# Altium schematic sheet 8051.SchDoc
size A
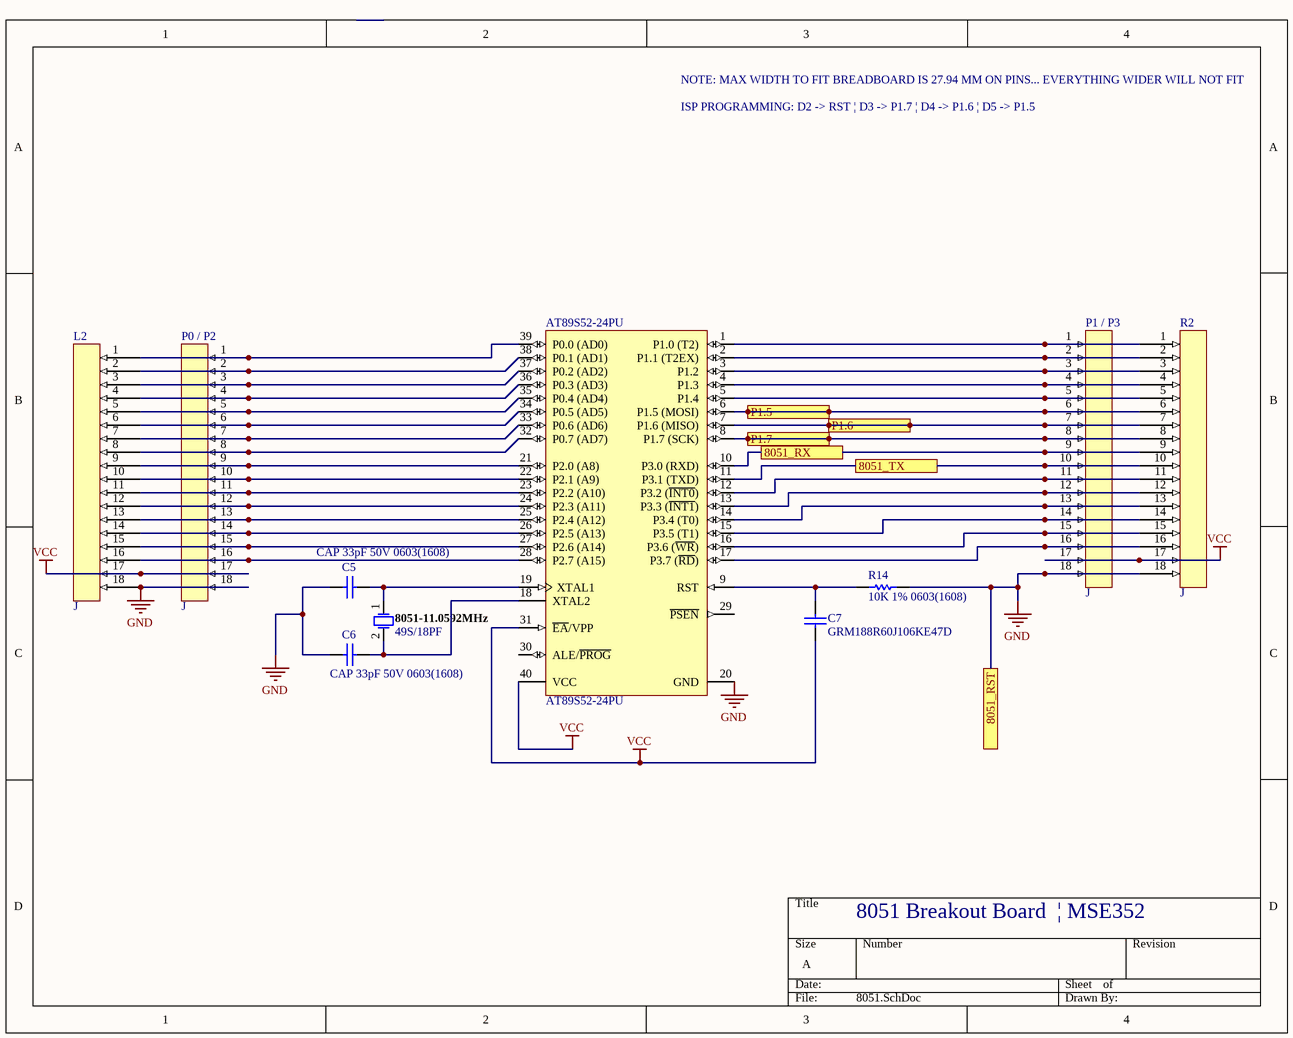
[diagram p0: 8051.SchDoc]

## Parts
8051-11.0592MHz  49S/18PF  [JPY-49S-18PF]
AT89S52-24PU  AT89S52-24PU  [ATML-40P6]
C5  CAP 33pF 50V 0603(1608)  [CAPC0603(1608)100_L]
C6  CAP 33pF 50V 0603(1608)  [CAPC0603(1608)100_L]
C7  GRM188R60J106KE47D  [CAPC1608X90X38LL10T18]
L2  J  [16 pin holes]
P0_/_P2  J  [16 pin holes]
P1_/_P3  J  [16 pin holes]
R2  J  [16 pin holes]
R14  10K 1% 0603(1608)  [RESC0603(1608)_N]

## Ports
8051_RST, 8051_RX, 8051_TX, P1.5, P1.6, P1.7

## Nets
GND: AT89S52-24PU.20(GND) C5.1 C6.1 L2.18 P0_/_P2.18 P1_/_P3.18 R2.18 R14.2 ; port 8051_RST
VCC: AT89S52-24PU.31(~{EA}/VPP) AT89S52-24PU.40(VCC) C7.1 L2.17 P0_/_P2.17 P1_/_P3.17 R2.17
8051_RX: AT89S52-24PU.10(P3.0_(RXD)) P1_/_P3.9 R2.9 ; port 8051_RX
8051_TX: AT89S52-24PU.11(P3.1_(TXD)) P1_/_P3.10 R2.10 ; port 8051_TX
P1.5: AT89S52-24PU.6(P1.5_(MOSI)) P1_/_P3.6 R2.6 ; port P1.5
P1.6: AT89S52-24PU.7(P1.6_(MISO)) P1_/_P3.7 R2.7 ; port P1.6
P1.7: AT89S52-24PU.8(P1.7_(SCK)) P1_/_P3.8 R2.8 ; port P1.7
Net8051-11.0592MHz_1: 8051-11.0592MHz.1 AT89S52-24PU.19(XTAL1) C5.2
Net8051-11.0592MHz_2: 8051-11.0592MHz.2 AT89S52-24PU.18(XTAL2) C6.2
NetAT89S52-24PU_1: AT89S52-24PU.1(P1.0_(T2)) P1_/_P3.1 R2.1
NetAT89S52-24PU_2: AT89S52-24PU.2(P1.1_(T2EX)) P1_/_P3.2 R2.2
NetAT89S52-24PU_3: AT89S52-24PU.3(P1.2) P1_/_P3.3 R2.3
NetAT89S52-24PU_4: AT89S52-24PU.4(P1.3) P1_/_P3.4 R2.4
NetAT89S52-24PU_5: AT89S52-24PU.5(P1.4) P1_/_P3.5 R2.5
NetAT89S52-24PU_9: AT89S52-24PU.9(RST) C7.2 R14.1
NetAT89S52-24PU_12: AT89S52-24PU.12(P3.2_(~{INT0})) P1_/_P3.11 R2.11
NetAT89S52-24PU_13: AT89S52-24PU.13(P3.3_(~{INT1})) P1_/_P3.12 R2.12
NetAT89S52-24PU_14: AT89S52-24PU.14(P3.4_(T0)) P1_/_P3.13 R2.13
NetAT89S52-24PU_15: AT89S52-24PU.15(P3.5_(T1)) P1_/_P3.14 R2.14
NetAT89S52-24PU_16: AT89S52-24PU.16(P3.6_(~{WR})) P1_/_P3.15 R2.15
NetAT89S52-24PU_17: AT89S52-24PU.17(P3.7_(~{RD})) P1_/_P3.16 R2.16
NetAT89S52-24PU_21: AT89S52-24PU.21(P2.0_(A8)) L2.9 P0_/_P2.9
NetAT89S52-24PU_22: AT89S52-24PU.22(P2.1_(A9)) L2.10 P0_/_P2.10
NetAT89S52-24PU_23: AT89S52-24PU.23(P2.2_(A10)) L2.11 P0_/_P2.11
NetAT89S52-24PU_24: AT89S52-24PU.24(P2.3_(A11)) L2.12 P0_/_P2.12
NetAT89S52-24PU_25: AT89S52-24PU.25(P2.4_(A12)) L2.13 P0_/_P2.13
NetAT89S52-24PU_26: AT89S52-24PU.26(P2.5_(A13)) L2.14 P0_/_P2.14
NetAT89S52-24PU_27: AT89S52-24PU.27(P2.6_(A14)) L2.15 P0_/_P2.15
NetAT89S52-24PU_28: AT89S52-24PU.28(P2.7_(A15)) L2.16 P0_/_P2.16
NetAT89S52-24PU_32: AT89S52-24PU.32(P0.7_(AD7)) L2.8 P0_/_P2.8
NetAT89S52-24PU_33: AT89S52-24PU.33(P0.6_(AD6)) L2.7 P0_/_P2.7
NetAT89S52-24PU_34: AT89S52-24PU.34(P0.5_(AD5)) L2.6 P0_/_P2.6
NetAT89S52-24PU_35: AT89S52-24PU.35(P0.4_(AD4)) L2.5 P0_/_P2.5
NetAT89S52-24PU_36: AT89S52-24PU.36(P0.3_(AD3)) L2.4 P0_/_P2.4
NetAT89S52-24PU_37: AT89S52-24PU.37(P0.2_(AD2)) L2.3 P0_/_P2.3
NetAT89S52-24PU_38: AT89S52-24PU.38(P0.1_(AD1)) L2.2 P0_/_P2.2
NetAT89S52-24PU_39: AT89S52-24PU.39(P0.0_(AD0)) L2.1 P0_/_P2.1

Not connected (* = marked no-connect by the designer): AT89S52-24PU 29(~{PSEN}) 30(ALE/~{PROG})

## Notes on the sheet
- NOTE: MAX WIDTH TO FIT BREADBOARD IS 27.94 MM ON PINS... EVERYTHING WIDER WILL NOT FIT
- ISP PROGRAMMING: D2 -> RST | D3 -> P1.7 | D4 -> P1.6 | D5 -> P1.5
- 8051 Breakout Board  | MSE352

## Library data of the parts
8051-11.0592MHz = CMP-2100-03581-1: Crystal, 16 MHz, 18 pF, -20 to 70 degC, 2-Pin THD; Manufacturer: Shenzhen Jingpengyuan; Package Description: 2-Pin Through Hole Device, Body 11.05 x 4.65 mm, Pitch 4.88 mm; Package Reference: 49S-18PF; Datasheet Version: 41852.0; Datasheet URL: http://datasheet.octopart.com/49S-18PF-Xinhunjing-datasheet-30677139.pdf; Manufacturer URL: http://www.chjiahui.com/
AT89S52-24PU = CMP-2000-07438-1: Microcontroller with In-System Programmable Flash, 4 to 5.5 V, 8 KB Flash, -40 to 85 degC, 40-Pin PDIP (40P6), RoHS, Tube; Manufacturer: Microchip; Package Version: Rev. B, 09/2001; Datasheet Version: Rev. 1919D, 06/2008; Manufacturer URL: http://www.microchip.com/; Package Reference: 40P6; Mounting Technology: ThroughHole; RoHSCompliant: false; Package Description: 40-Pin Plastic Double In-line Package, Body 52.324 x13.716 mm, Pitch 2.54 mm; Datasheet URL: http://ww1.microchip.com/downloads/en/DeviceDoc/doc1919.pdf
C5 C6 = CMP-1035-00942-1: CAP 33pF 50V ±2% 0603 (1608 Metric) Thickness 1mm SMD; Case-Metric: 1608; Tolerance: Â±2%; Case-EIA: 0603; Value: 33pF; Rated Voltage: 50 V; Max Thickness: 1 mm; Technology: SMT
C7 = CMP-2000-07518-1: Chip Capacitor, 10 uF, +/- 10%, 6.3 V, -55 to 85 degC, 0603 (1608 Metric), RoHS, Tape and Reel; Manufacturer: Murata; Voltage Rating: 6.3V; Capacitance: 10uF; Dielectric: X5R; Material: Ceramic; Datasheet Version: 03/2016; Depth: 0.8mm; Height: 0.8mm; Termination: SMD/SMT; Thickness: 0.035inch; Voltage Rating (DC): 6.3V; Package Reference: 603; Package Quantity: 4000; Weight: 0.000222oz; Manufacturer URL: http://www.murata.com/; Datasheet URL: http://search.murata.co.jp/Ceramy/image/img/A01X/G101/ENG/GRM188R60J106KE47-02.pdf; Width: 0.031inch; Min Operating Temperature: -55degC; Mounting Technology: SurfaceMount; REACH SVHC: NoSVHC; Length: 1.6mm; Case Code (Imperial): 0603; Case/Package: 0603; Case Code (Metric): 1608; RoHSCompliant: True; Tolerance: 10%; Package Description: 2-Pin Surface Mount Device, Body 1.6 x 0.8 mm; Mount: SurfaceMount; Max Operating Temperature: 85degC; Packaging: TapeandReel
L2 P0_/_P2 P1_/_P3 R2 = 16 pin holes
R14 = CMP-1012-00623-1: 10K 0.1W 1% 0603 (1608 Metric)  SMD; Value: 10000.00 Ohm; Case-EIA: 0603; Case-Metric: 1608; Power: 0.1 W; Tolerance: 1 %; Technology: SMT